# Altium schematic sheet 15_Temp.SchDoc: Power
size A3; Organization: Lime Microsystems; Address1: Surrey Tech Centre; Address2: Guildford GU2 7YG; Address3: Surrey; Address4: United Kingdom; Revision: v1.2; SheetNumber: 13; SheetTotal: 13
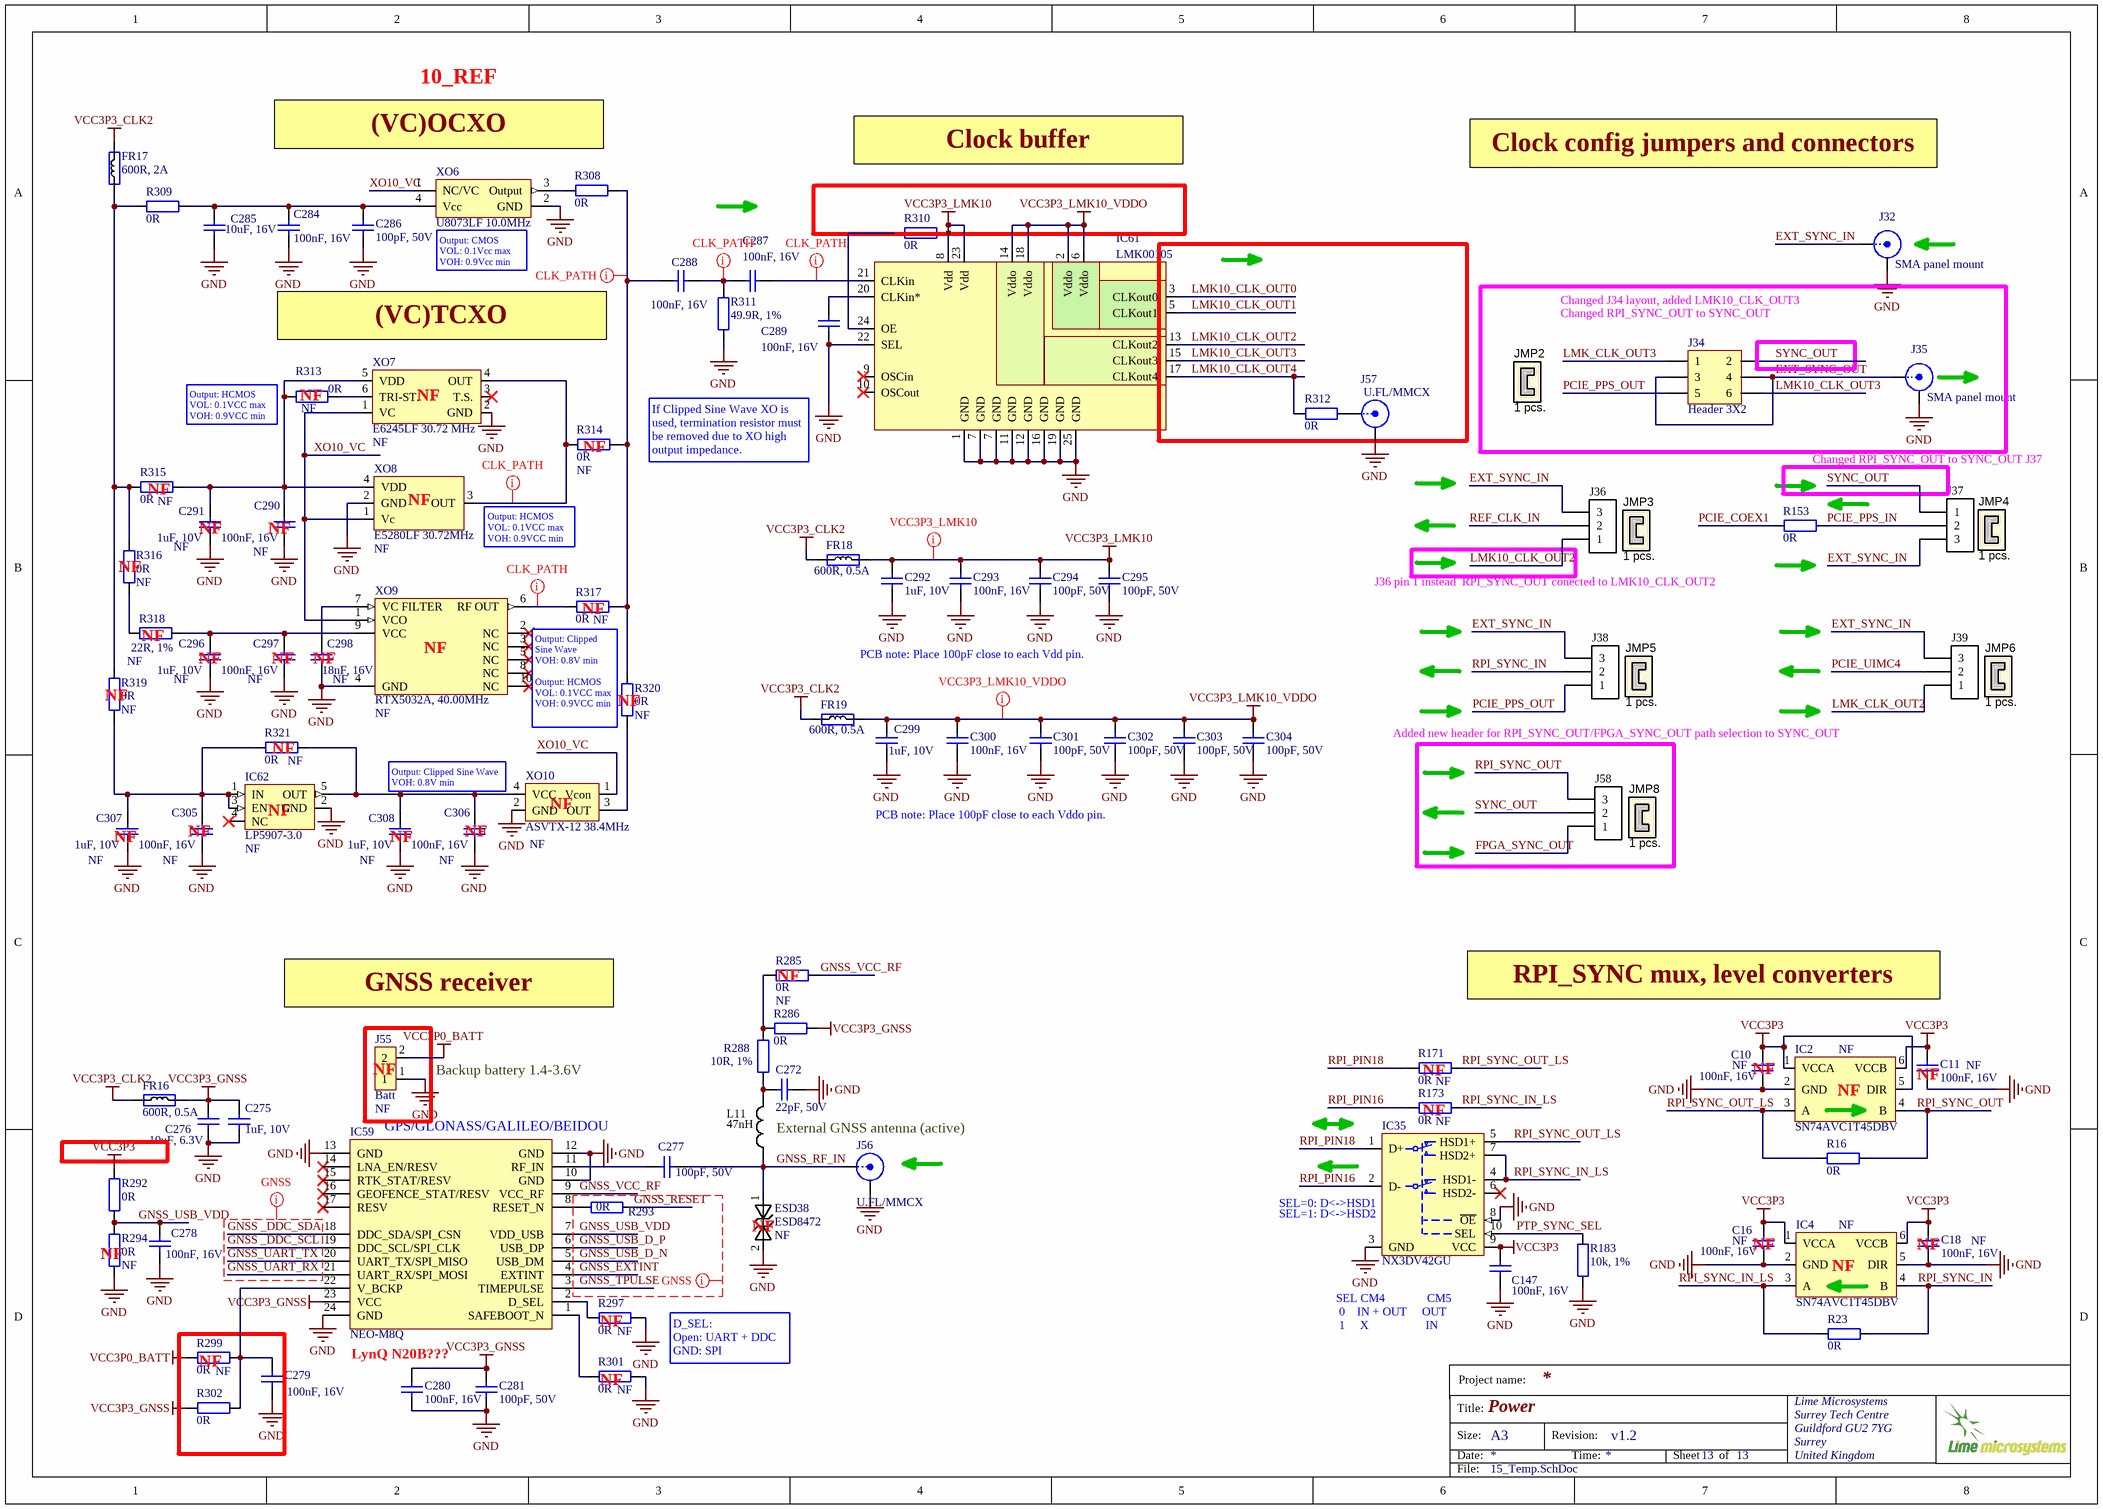
[diagram p0: 15_Temp.SchDoc]

## Parts
C10  100nF, 16V  Assembly Info: NF  [CAP0402]
C11  100nF, 16V  Assembly Info: NF  [CAP0402]
C16  100nF, 16V  Assembly Info: NF  [CAP0402]
C18  100nF, 16V  Assembly Info: NF  [CAP0402]
C147  100nF, 16V  [CAP0402]
C272  22pF, 50V  [CAP0402]
C275  1uF, 10V  [CAP0402]
C276  10uF, 6.3V  [CAP0603]
C277  100pF, 50V  [CAP0402]
C278  100nF, 16V  [CAP0402]
C279  100nF, 16V  [CAP0402]
C280  100nF, 16V  [CAP0402]
C281  100pF, 50V  [CAP0402]
C284  100nF, 16V  [CAP0402]
C285  10uF, 16V  [CAP0603]
C286  100pF, 50V  [CAP0402]
C287  100nF, 16V  [CAP0402]
C288  100nF, 16V  [CAP0402]
C289  100nF, 16V  [CAP0402]
C290  100nF, 16V  Assembly Info: NF  [CAP0402]
C291  1uF, 10V  Assembly Info: NF  [CAP0402]
C292  1uF, 10V  [CAP0402]
C293  100nF, 16V  [CAP0402]
C294  100pF, 50V  [CAP0402]
C295  100pF, 50V  [CAP0402]
C296  1uF, 10V  Assembly Info: NF  [CAP0402]
C297  100nF, 16V  Assembly Info: NF  [CAP0402]
C298  18nF, 16V  Assembly Info: NF  [CAP0402]
C299  1uF, 10V  [CAP0402]
C300  100nF, 16V  [CAP0402]
C301  100pF, 50V  [CAP0402]
C302  100pF, 50V  [CAP0402]
C303  100pF, 50V  [CAP0402]
C304  100pF, 50V  [CAP0402]
C305  100nF, 16V  Assembly Info: NF  [CAP0402]
C306  100nF, 16V  Assembly Info: NF  [CAP0402]
C307  1uF, 10V  Assembly Info: NF  [CAP0402]
C308  1uF, 10V  Assembly Info: NF  [CAP0402]
ESD38  ESD8472  Assembly Info: NF  [ESD8472_X3DFN2]
FR16  value 600R, 0.5A  [RES0402]  (hidden comment: Ferrite)
FR17  600R, 2A  [RES0805]
FR18  600R, 0.5A  [RES0402]
FR19  600R, 0.5A  [RES0402]
IC2  SN74AVC1T45DBV  Assembly Info: NF  [SOT23-6]
IC4  SN74AVC1T45DBV  Assembly Info: NF  [SOT23-6]
IC35  NX3DV42GU  [FSUSB42UMX]
IC59  NEO-M8Q  [NEO-7M/8M]
IC61  LMK00105  [LMK00105SQ]
IC62  LP5907-3.0  Assembly Info: NF  [SOT23-5]
J32  SMA panel mount  [SMA_connector_side]
J34  Header 3X2  [Header3x2]
J35  SMA panel mount  [SMA_connector_side]
J36  Header 3x1 pin  [HDR_1x3]  (value not drawn)
J37  Header 3x1 pin  [HDR_1x3]  (value not drawn)
J38  Header 3x1 pin  [HDR_1x3]  (value not drawn)
J39  Header 3x1 pin  [HDR_1x3]  (value not drawn)
J55  Batt  Assembly Info: NF  [HDR_1x2]
J56  U.FL/MMCX  [MMCX_UFL_conn_u]
J57  U.FL/MMCX  [MMCX_UFL_conn_u]
J58  Header 3x1 pin  [HDR_1x3]  (value not drawn)
JMP2  1 pcs.  (mechanical)
JMP3  1 pcs.  (mechanical)
JMP4  1 pcs.  (mechanical)
JMP5  1 pcs.  (mechanical)
JMP6  1 pcs.  (mechanical)
JMP8  1 pcs.  (mechanical)
L11  47nH  [RES0402]
R16  0R  [RES0402]
R23  0R  [RES0402]
R153  0R  [RES0402]
R171  0R  Assembly Info: NF  [RES0402]
R173  0R  Assembly Info: NF  [RES0402]
R183  10k, 1%  [RES0402]
R285  0R  Assembly Info: NF  [RES0402]
R286  0R  [RES0402]
R288  10R, 1%  [RES0402]
R292  0R  [RES0402]
R293  0R  [RES0402]
R294  0R  Assembly Info: NF  [RES0402]
R297  0R  Assembly Info: NF  [RES0402]
R299  0R  Assembly Info: NF  [RES0402]
R301  0R  Assembly Info: NF  [RES0402]
R302  0R  [RES0402]
R308  0R  [RES0402_v2]
R309  0R  [RES0402]
R310  0R  [RES0402]
R311  49.9R, 1%  [RES0402]
R312  0R  [RES0402]
R313  0R  Assembly Info: NF  [RES0402]
R314  0R  Assembly Info: NF  [RES0402_v2]
R315  0R  Assembly Info: NF  [RES0402]
R316  0R  Assembly Info: NF  [RES0402]
R317  0R  Assembly Info: NF  [RES0402_v2]
R318  22R, 1%  Assembly Info: NF  [RES0402]
R319  0R  Assembly Info: NF  [RES0402]
R320  0R  Assembly Info: NF  [RES0402_v2]
R321  0R  Assembly Info: NF  [RES0402]
XO6  U8073LF 10.0MHz  [AOCJYR-10.000MHz]
XO7  E6245LF 30.72 MHz  Assembly Info: NF  [RAKON_RPT7050A]
XO8  E5280LF 30.72MHz  Assembly Info: NF  [RAKON_TXCO]
XO9  RTX5032A, 40.00MHz  Assembly Info: NF  [RAKON_RTX5032A]
XO10  ASVTX-12 38.4MHz  Assembly Info: NF  [CRYSTAL_4-LCC_2P5x2P0]

## Nets
GND: C10.2 C11.2 C16.2 C18.2 C147.2 C272.1 C275.1 C276.1 C278.2 C279.2 C280.1 C281.2 C284.1 C285.1 C286.2 C289.1 C290.1 C291.1 C292.1 C293.1 C294.1 C295.1 C296.1 C297.1 C298.1 C299.1 C300.1 C301.1 C302.1 C303.1 C304.1 C305.1 C306.1 C307.1 C308.1 ESD38.2 IC2.2(GND) IC4.2(GND) IC4.5(DIR) IC35.3(GND) IC35.8(~{OE}) IC59.10(GND) IC59.12(GND) IC59.13(GND) IC59.24(GND) IC61.1(GND) IC61.7(GND) IC61.11(GND) IC61.12(GND) IC61.16(GND) IC61.19(GND) IC61.22(SEL) IC61.25(GND) IC62.2(GND) J32.2(Y) J35.2(Y) J55.1 J56.2(Y) J57.2(Y) R183.2 R294.1 R297.1 R301.1 R311.1 XO6.2(GND) XO7.2(GND) XO8.2(GND) XO9.4(GND) XO10.2(GND)
VCC3P0_BATT: J55.2 R299.2
VCC3P3: C10.1 C11.1 C16.1 C18.1 C147.1 IC2.1(VCCA) IC2.5(DIR) IC2.6(VCCB) IC4.1(VCCA) IC4.6(VCCB) IC35.9(VCC) R292.1
VCC3P3_CLK2: FR16.1 FR17.1 FR18.1 FR19.1
VCC3P3_GNSS: C275.2 C276.2 C280.2 C281.1 FR16.2 IC59.23(VCC) R286.1 R302.2
VCC3P3_LMK10: C292.2 C293.2 C294.2 C295.2 FR18.2 IC61.8(Vdd) IC61.23(Vdd) R310.2
VCC3P3_LMK10_VDDO: C299.2 C300.2 C301.2 C302.2 C303.2 C304.2 FR19.2 IC61.2(Vddo) IC61.6(Vddo) IC61.14(Vddo) IC61.18(Vddo)
EXT_SYNC_IN: J32.1(X) J36.3 J37.3 J38.3 J39.3
EXT_SYNC_OUT: J34.3 J34.4 J35.1(X)
FPGA_SYNC_OUT: J58.1
GNSS _DDC_SCL: IC59.19(DDC_SCL/SPI_CLK)
GNSS _DDC_SDA: IC59.18(DDC_SDA/SPI_CSN)
GNSS_EXTINT: IC59.4(EXTINT)
GNSS_RESET: R293.1
GNSS_RF_IN: C277.1 ESD38.1 J56.1(X) L11.1
GNSS_TPULSE: IC59.3(TIMEPULSE)
GNSS_UART_RX: IC59.21(UART_RX/SPI_MOSI)
GNSS_UART_TX: IC59.20(UART_TX/SPI_MISO)
GNSS_USB_D_N: IC59.5(USB_DM)
GNSS_USB_D_P: IC59.6(USB_DP)
GNSS_USB_VDD: C278.1 IC59.7(VDD_USB) R292.2 R294.2
GNSS_VCC_RF: IC59.9(VCC_RF) R285.2
LMK10_CLK_OUT0: IC61.3(CLKout0)
LMK10_CLK_OUT1: IC61.5(CLKout1)
LMK10_CLK_OUT2: IC61.13(CLKout2) J36.1
LMK10_CLK_OUT3: IC61.15(CLKout3) J34.6
LMK10_CLK_OUT4: IC61.17(CLKout4) R312.2
LMK_CLK_OUT2: J39.1
LMK_CLK_OUT3: J34.1
PCIE_COEX1: R153.2
PCIE_PPS_IN: J37.2 R153.1
PCIE_PPS_OUT: J34.5 J38.1
PCIE_UIMC4: J39.2
PTP_SYNC_SEL: IC35.10(SEL) R183.1
REF_CLK_IN: J36.2
RPI_PIN16: IC35.2(D-) R173.2
RPI_PIN18: IC35.1(D+) R171.2
RPI_SYNC_IN: IC4.4(B) J38.2 R23.1
RPI_SYNC_IN_LS: IC4.3(A) IC35.4(HSD1-) IC35.7(HSD2+) R23.2 R173.1
RPI_SYNC_OUT: IC2.4(B) J58.3 R16.1
RPI_SYNC_OUT_LS: IC2.3(A) IC35.5(HSD1+) R16.2 R171.1
SYNC_OUT: J34.2 J37.1 J58.2
XO10_VC: XO6.1(NC/VC) XO7.1(VC) XO8.1(Vc) XO9.1(VCO) XO10.1(Vcon)
NetC272_2: C272.2 L11.2 R288.1
NetC277_2: C277.2 IC59.11(RF_IN)
NetC279_1: C279.1 IC59.22(V_BCKP) R299.1 R302.1
NetC284_2: C284.2 C285.2 C286.1 R309.2 XO6.4(Vcc)
NetC287_1: C287.1 IC61.21(CLKin)
NetC287_2: C287.2 C288.1 R311.2
NetC288_2: C288.2 R308.1 R314.1 R317.2 R320.1
NetC289_2: C289.2 IC61.20(CLKin*)
NetC290_2: C290.2 C291.2 R313.2 R315.1 XO7.5(VDD) XO8.4(VDD)
NetC296_2: C296.2 C297.2 R318.2 XO9.9(VCC)
NetC298_2: C298.2 XO9.7(VC_FILTER)
NetC305_2: C305.2 C307.2 IC62.1(IN) IC62.3(EN) R319.2 R321.2
NetC306_2: C306.2 C308.2 IC62.5(OUT) R321.1 XO10.4(VCC)
NetFR17_2: FR17.2 R309.1 R315.2 R316.1 R319.1
NetIC59_1: IC59.1(SAFEBOOT_N) R301.2
NetIC59_2: IC59.2(D_SEL) R297.2
NetIC59_8: IC59.8(RESET_N) R293.2
NetIC61_24: IC61.24(OE) R310.1
NetJ57_1: J57.1(X) R312.1
NetR285_1: R285.1 R286.2 R288.2
NetR308_2: R308.2 XO6.3(Output)
NetR313_1: R313.1 XO7.6(TRI-ST.)
NetR314_2: R314.2 XO7.4(OUT) XO8.3(OUT)
NetR316_2: R316.2 R318.1
NetR317_1: R317.1 XO9.6(RF_OUT)
NetR320_2: R320.2 XO10.3(OUT)

Not connected (* = marked no-connect by the designer): IC35 6(HSD2-)*; IC59 14(LNA_EN/RESV)* 15(RTK_STAT/RESV)* 16(GEOFENCE_STAT/RESV)* 17(RESV)*; IC61 9(OSCin)* 10(OSCout)*; IC62 4(NC)*; JMP2 1 2; JMP3 1 2; JMP4 1 2; JMP5 1 2; JMP6 1 2; JMP8 1 2; XO7 3(T.S.)*; XO9 2(NC)* 3(NC)* 5(NC)* 8(NC)* 10(NC)*

## Layout directives
net class CLK_PATH: NetC287_1, NetC287_2, NetC288_2, NetR314_2, NetR317_1
net class VCC3P3_LMK10: VCC3P3_LMK10
net class VCC3P3_LMK10_VDDO: VCC3P3_LMK10_VDDO
net class GNSS: GNSS _DDC_SCL, GNSS _DDC_SDA, GNSS_EXTINT, GNSS_RESET, GNSS_TPULSE, GNSS_UART_RX, GNSS_UART_TX, GNSS_USB_D_N, GNSS_USB_D_P, GNSS_USB_VDD

## Notes on the sheet
- 10_REF
- (VC)OCXO
- Clock buffer
- Clock config jumpers and connectors
- (near XO6) Output: CMOS
  VOL: 0.1Vcc max
  VOH: 0.9Vcc min
- Changed J34 layout, added LMK10_CLK_OUT3
- Changed RPI_SYNC_OUT to SYNC_OUT
- (VC)TCXO
- (near R313) Output: HCMOS
  VOL: 0.1VCC max
  VOH: 0.9VCC min
- (near R313) NF
- (near XO7) NF
- (near R314) NF
- (near R315) NF
- (near XO8) NF
- (near R314) If Clipped Sine Wave XO is used, termination resistor must be removed due to XO high output impedance.
- Changed RPI_SYNC_OUT to SYNC_OUT J37
- (near R316) NF
- (near C291) NF
- (near C290) NF
- (near XO8) Output: HCMOS
  VOL: 0.1VCC max
  VOH: 0.9VCC min
- (near J36) J36 pin 1 instead  RPI_SYNC_OUT conected to LMK10_CLK_OUT2
- (near R318) NF
- (near XO9) NF
- (near R317) NF
- (near R319) NF
- (near C296) NF
- (near C297) NF
- (near C298) NF
- (near R320) Output: Clipped Sine Wave
  VOH: 0.8V min
  Output: HCMOS
  VOL: 0.1VCC max
  VOH: 0.9VCC min
- (near R320) NF
- PCB note: Place 100pF close to each Vdd pin.
- (near R321) NF
- Output: Clipped Sine Wave
  VOH: 0.8V min
- Added new header for RPI_SYNC_OUT/FPGA_SYNC_OUT path selection to SYNC_OUT
- (near C307) NF
- (near C305) NF
- (near IC62) NF
- (near C308) NF
- (near C306) NF
- (near XO10) NF
- PCB note: Place 100pF close to each Vddo pin.
- (near R285) NF
- (near J55) GNSS receiver
- RPI_SYNC mux, level converters
- (near J55) NF
- (near J55) Backup battery 1.4-3.6V
- (near R171) NF
- (near R173) NF
- (near C10) NF
- (near IC2) NF
- (near C11) NF
- (near IC59) GPS/GLONASS/GALILEO/BEIDOU
- (near L11) External GNSS antenna (active)
- (near R294) NF
- (near ESD38) NF
- (near IC35) SEL=0: D<->HSD1
- (near IC35) SEL=1: D<->HSD2
- (near C16) NF
- (near C18) NF
- (near R297) NF
- (near IC4) NF
- (near R299) NF
- LynQ N20B???
- (near R301) NF
- D_SEL:
  Open: UART + DDC
  GND: SPI
- (near C147) SEL CM4              CM5
  0    IN + OUT     OUT
  1     X                   IN
- Project name:
- Title:
- Size:
- Date:
- A3
- Revision:
- Time:
- Sheet
- of
- File:

## Library data of the parts
C10 C11 C16 C18 C147 C284 C287-C290 C293 C297 C300 = Cap_0402: Manufacturer: Murata Electronics; Manufacturer Part Number: GRM155R71C104KA88D; Part Description: 0.10µF ±10% 16V Ceramic Capacitor X7R 0402 (1005 Metric); Tolerance: 10 %; Type: General Purpose MLCC; Capacitance: 0.1 uF; Case Length: 1 mm; Dielectric: X7R; Case Height: 0.5 mm; Temperature Coefficient / Code: +/- 15 %; Value: 100nF, 16V; Supplier 1: Mouser; Supplier Part Number 1: 81-GRM155R71C104KA88; Case Code - in: 0402; RoHS: RoHS Compliant; Operating Temperature Range: - 55 C to + 125 C; Series: GRM; Termination Style: SMD/SMT; Package / Case: 0402 (1005 metric); Voltage Rating DC: 16 V; Maximum Operating Temperature: + 125 C; Case Code - mm: 1005; Minimum Operating Temperature: - 55 C; Product Category: Low & Medium Capacitance SMD Ceramic Chip Capacitors; Packaging: Reel; Product: General Type MLCCs; Category: Multilayer Ceramic Capacitors MLCC - SMD/SMT; Brand: Murata Electronics; Case Width: 0.5 mm; RoHS - Mouser: Y; Standard Pack Qty: 10000; Minimum Order Quantity: 1; Reeling: True; Manufacturer Part Number 1: GRM155R71C104KA88D
C272 = Cap_0402: Manufacturer: Yageo; Manufacturer Part Number 1: CC0402JRNPO9BN220; Part Description: 22pF ±5% 50V C0G, NP0 Ceramic Capacitor -55°C ~ 125°C Surface Mount, MLCC 0402 (1005 Metric) 0.039" L x 0.020" W (1.00mm x 0.50mm); Tolerance: ±5%; Temperature Coefficient: C0G, NP0; Value: 22pF, 50V; Supplier 1: Digi-Key; Supplier Part Number 1: 311-1018-2-ND; Category: Capacitors; Voltage - Rated: 50V; Packaging: Tape & Reel (TR); RoHS: RoHS Compliant; Capacitance: 22pF; Operating Temperature: -55°C ~ 125°C; Mounting Type: Surface Mount, MLCC; Height - Seated (Max): -; Size / Dimension: 0.039" L x 0.020" W (1.00mm x 0.50mm); Ratings: -; Applications: General Purpose; Thickness (Max): 0.022" (0.55mm); Lead Spacing: -; Lead Style: -; Features: -; Package / Case: 0402 (1005 Metric)
C275 = Cap_0402: CAP CER 1UF 10V X5R 0402; Manufacturer: TDK; Part Description: 1µF ±10% 10V X5R Ceramic Capacitor -55°C ~ 85°C Surface Mount, MLCC 0402 (1005 Metric) 0.039" L x 0.020" W (1.00mm x 0.50mm); Manufacturer Part Number 1: C1005X5R1E105K050BC; Voltage Rating: 10; Capacitance: 1; Capacitance Tolerance: ± 10%; Ceramic Capacitor Case: 0402 [1005 Metric]; Dielectric Characteristic: X6; Product Range: TDK - C Series; Value: 1uF, 10V; Supplier 1: Digi-Key; Supplier Part Number 1: 445-9066-1-ND; RoHS: YES; MSL: -
C276 = Cap_0603: Manufacturer Part Number 1: CC0603MRX5R5BB106; Manufacturer: Yageo; Part Description: 10µF ±20% 6.3V X5R Ceramic Capacitor -55°C ~ 85°C Surface Mount, MLCC 0603 (1608 Metric) 0.063" L x 0.031" W (1.60mm x 0.80mm); Capacitance: 10µF; Tolerance: ±20%; Supplier 1: Digi-Key; Supplier Part Number 1: 311-1448-2-ND; Package / Case: 0603 (1608 Metric); Category: Capacitors; Voltage - Rated: 6.3V; Value: 10uF, 6.3V
C277 C281 C286 = Cap_0402: Manufacturer Part Number 1: CC0402JRNPO9BN101; Manufacturer: Yageo; Part Description: 100pF ±5% 50V C0G, NP0 Ceramic Capacitor -55°C ~ 125°C Surface Mount, MLCC 0402 (1005 Metric) 0.039" L x 0.020" W (1.00mm x 0.50mm); Tolerance: ±5%; Temperature Coefficient: C0G, NP0; Value: 100pF, 50V; Capacitance: 100pF; Thickness (Max): 0.022" (0.55mm); Size / Dimension: 0.039" L x 0.020" W (1.00mm x 0.50mm); RoHS: RoHS Compliant; Ratings: -; Package / Case: 0402 (1005 Metric); Mounting Type: Surface Mount, MLCC; Height - Seated (Max): -; Features: -; Lead Spacing: -; Voltage - Rated: 50V; Operating Temperature: -55°C ~ 125°C; Packaging: Cut Tape (CT); Applications: General Purpose; Lead Style: -; Supplier 1: Digi-Key; Category: Capacitors; Supplier Part Number 1: 311-1024-1-ND
C278 C279 = Cap_0603: Manufacturer Part Number 1: GRM155R71C104KA88D; Part Description: 0.10µF ±10% 16V X7R Ceramic Capacitor -55°C ~ 125°C Surface Mount, MLCC 0402 (1005 Metric) 0.039" L x 0.020" W (1.00mm x 0.50mm); Brand: Murata Electronics; Tolerance: 10 %; Type: General Purpose MLCC; Capacitance: 0.1 uF; Temperature Coefficient / Code: +/- 15 %; Case Height: 0.5 mm; Case Length: 1 mm; Dielectric: X7R; Supplier 1: Mouser; Supplier Part Number 1: 81-GRM155R71C104KA88; Case Code - in: 0402; Manufacturer: Murata Electronics; Category: Multilayer Ceramic Capacitors MLCC - SMD/SMT; Voltage Rating DC: 16 V; Value: 100nF, 16V; Manufacturer Part Number: GRM155R71C104KA88D; Case Code - mm: 1005; Case Width: 0.5 mm; Maximum Operating Temperature: + 125 C; Minimum Operating Temperature: - 55 C; Minimum Order Quantity: 1; Operating Temperature Range: - 55 C to + 125 C; Package / Case: 0402 (1005 metric); Packaging: Reel; Product: General Type MLCCs; Product Category: Low & Medium Capacitance SMD Ceramic Chip Capacitors; Reeling: True; RoHS - Mouser: Y; RoHS: RoHS Compliant; Series: GRM; Standard Pack Qty: 10000; Termination Style: SMD/SMT
C280 = Cap_0402: Manufacturer: Murata Electronics; Manufacturer Part Number: GRM155R71C104KA88D; Part Description: 0.10µF ±10% 16V X7R Ceramic Capacitor -55°C ~ 125°C Surface Mount, MLCC 0402 (1005 Metric) 0.039" L x 0.020" W (1.00mm x 0.50mm); Tolerance: 10 %; Type: General Purpose MLCC; Capacitance: 0.1 uF; Case Length: 1 mm; Dielectric: X7R; Case Height: 0.5 mm; Temperature Coefficient / Code: +/- 15 %; Value: 100nF, 16V; Supplier 1: Mouser; Supplier Part Number 1: 81-GRM155R71C104KA88; Case Code - in: 0402; RoHS: RoHS Compliant; Operating Temperature Range: - 55 C to + 125 C; Series: GRM; Termination Style: SMD/SMT; Package / Case: 0402 (1005 metric); Voltage Rating DC: 16 V; Maximum Operating Temperature: + 125 C; Case Code - mm: 1005; Minimum Operating Temperature: - 55 C; Product Category: Low & Medium Capacitance SMD Ceramic Chip Capacitors; Packaging: Reel; Product: General Type MLCCs; Category: Multilayer Ceramic Capacitors MLCC - SMD/SMT; Brand: Murata Electronics; Case Width: 0.5 mm; RoHS - Mouser: Y; Standard Pack Qty: 10000; Minimum Order Quantity: 1; Reeling: True; Manufacturer Part Number 1: GRM155R71C104KA88D
C285 = Cap_0603: Manufacturer: Yageo; Manufacturer Part Number 1: GRM188R61C106MA73D; Part Description: 10µF ±20% 16V Ceramic Capacitor X5R 0603 (1608 Metric); Temperature Coefficient: X5R; Capacitance: 10µF; Tolerance: ±20%; Value: 10uF, 16V; Supplier 1: Digi-Key; Supplier Part Number 1: 490-7201-2-ND; Category: Capacitors; Ratings: -; Features: -; Lead Style: -; Package / Case: 0603 (1608 Metric); Lead Spacing: -; Applications: General Purpose; Voltage - Rated: 16V; Operating Temperature: -55°C ~ 85°C; Thickness (Max): 0.039" (1.00mm); Mounting Type: Surface Mount, MLCC; RoHS: RoHS Compliant; Size / Dimension: 0.063" L x 0.031" W (1.60mm x 0.80mm); Packaging: Tape & Reel (TR); Height - Seated (Max): -
C291 C296 = Cap_0402: CAP CER 1UF 10V X5R 0402; Manufacturer: Yageo; Part Description: 1µF 10V Ceramic Capacitor X5R 0402 (1005 Metric) 0.039" L x 0.020" W (1.00mm x 0.50mm); Manufacturer Part Number 1: CC0402MRX5R6BB105; Voltage Rating: 10; Capacitance: 1; Capacitance Tolerance: ± 10%; Ceramic Capacitor Case: 0402 [1005 Metric]; Dielectric Characteristic: X6; Product Range: TDK - C Series; Value: 1uF, 10V; Supplier 1: Digi-Key; Supplier Part Number 1: 311-1732-1-ND; RoHS: YES; MSL: -
C292 C299 = Cap_0402: CAP CER 1UF 10V X5R 0402; Manufacturer: Yageo; Part Description: 1µF 10V Ceramic Capacitor X5R 0402 (1005 Metric) 0.039" L x 0.020" W (1.00mm x 0.50mm); Manufacturer Part Number 1: CC0402MRX5R6BB105; Notification: Current market demand for these product types have resulted in fluctuating and extending lead times. Lead times may differ.; Tolerance: ±20%; Value: 1uF, 10V; Supplier 1: Digi-Key; Supplier Part Number 1: 311-1732-1-ND; RoHS: RoHS Compliant; Applications: General Purpose; Category: Capacitors; ComponentLink1Description: http://www.yageo.com/documents/recent/UPY-GPHC_X5R_4V-to-50V_25.pdf; ComponentLink1URL: http://www.yageo.com/documents/recent/UPY-GPHC_X5R_4V-to-50V_25.pdf; Failure Rate: -; Features: -; Height - Seated (Max): -; Lead Spacing: -; Lead Style: -; Mounting Type: Surface Mount, MLCC; Operating Temperature: -55°C ~ 85°C; Package / Case: 0402 (1005 Metric); Packaging: Cut Tape (CT); Part Status: Active; Pricing 1: 1=0.22, 10=0.156, 100=0.0732, 500=0.0513, 1000=0.04248, 2500=0.03953, 5000=0.03617 (USD); Ratings: -; Size / Dimension: 0.039" L x 0.020" W (1.00mm x 0.50mm); Stock 1: 69600; Temperature Coefficient: X5R; Thickness (Max): 0.022" (0.55mm); Voltage - Rated: 10V
C294 C295 C301-C304 = Cap_0402: Manufacturer Part Number 1: CC0402JRNPO9BN101; Manufacturer: Yageo; Part Description: 100pF ±5% 50V C0G, NP0 Ceramic Capacitor -55°C ~ 125°C Surface Mount, MLCC 0402 (1005 Metric) 0.039" L x 0.020" W (1.00mm x 0.50mm); Temperature Coefficient: C0G, NP0; Tolerance: ±5%; Value: 100pF, 50V; Supplier 1: Digi-Key; Supplier Part Number 1: 311-1024-1-ND; RoHS: RoHS Compliant; Category: Capacitors; Applications: General Purpose; Mounting Type: Surface Mount, MLCC; Capacitance: 100pF; Ratings: -; Packaging: Cut Tape (CT); Voltage - Rated: 50V; Size / Dimension: 0.039" L x 0.020" W (1.00mm x 0.50mm); Height - Seated (Max): -; Package / Case: 0402 (1005 Metric); Operating Temperature: -55°C ~ 125°C; Features: -; Lead Spacing: -; Lead Style: -; Thickness (Max): 0.022" (0.55mm)
C298 = Cap_0402: Manufacturer: Yageo; Manufacturer Part Number 1: CC0402KRX7R7BB183; Part Description: 0.018µF ±10% 16V Ceramic Capacitor X7R 0402 (1005 Metric); Temperature Coefficient: X7R; Capacitance: 0.018µF; Tolerance: ±10%; Value: 18nF, 16V; Supplier 1: Digi-Key; Supplier Part Number 1: 311-1706-1-ND; Part Status: Active; Category: Capacitors; Packaging: Cut Tape (CT); Voltage - Rated: 16V; RoHS: RoHS Compliant; Size / Dimension: 0.039" L x 0.020" W (1.00mm x 0.50mm); Package / Case: 0402 (1005 Metric); Mounting Type: Surface Mount, MLCC; Thickness (Max): 0.022" (0.55mm); Applications: General Purpose; Operating Temperature: -55°C ~ 125°C
C305 C306 = Cap_0402: Manufacturer: Murata Electronics; Manufacturer Part Number 1: GRM155R71C104KA88D; Part Description: 0.10µF ±10% 16V Ceramic Capacitor X7R 0402 (1005 Metric); Tolerance: 10 %; Type: General Purpose MLCC; Capacitance: 0.1 uF; Case Length: 1 mm; Dielectric: X7R; Case Height: 0.5 mm; Temperature Coefficient / Code: +/- 15 %; Value: 100nF, 16V; Supplier 1: Mouser; Supplier Part Number 1: 81-GRM155R71C104KA88; Case Code - in: 0402; RoHS: RoHS Compliant; Operating Temperature Range: - 55 C to + 125 C; Series: GRM; Termination Style: SMD/SMT; Package / Case: 0402 (1005 metric); Voltage Rating DC: 16 V; Maximum Operating Temperature: + 125 C; Case Code - mm: 1005; Minimum Operating Temperature: - 55 C; Product Category: Low & Medium Capacitance SMD Ceramic Chip Capacitors; Packaging: Reel; Product: General Type MLCCs; Category: Multilayer Ceramic Capacitors MLCC - SMD/SMT; Brand: Murata Electronics; Case Width: 0.5 mm; RoHS - Mouser: Y; Standard Pack Qty: 10000; Minimum Order Quantity: 1; Reeling: True; Manufacturer Part Number: GRM155R71C104KA88D
C307 C308 = Cap_0402: Manufacturer Part Number 1: CC0402MRX5R6BB105; Manufacturer: Yageo; Part Description: 1µF 10V Ceramic Capacitor X5R 0402 (1005 Metric) 0.039" L x 0.020" W (1.00mm x 0.50mm); Voltage Rating: 10; Capacitance Tolerance: ± 10%; Product Range: TDK - C Series; Ceramic Capacitor Case: 0402 [1005 Metric]; Capacitance: 1; Dielectric Characteristic: X6; Value: 1uF, 10V; Supplier 1: Digi-Key; Supplier Part Number 1: 311-1732-1-ND; MSL: -; RoHS: YES
ESD38 = ESD8472: Manufacturer: ON Semiconductor; Manufacturer Part Number: ESD8472MUT5G; Part Description: TVS DIODE 5.3VWM 14VC X3DFN2; Voltage - Reverse Standoff (Typ): 5.3V (Max); Voltage - Breakdown (Min): 7V; Voltage - Clamping (Max) @ Ipp: 14V; Current - Peak Pulse (10/1000µs): 3A (8/20µs); Power Line Protection: No; Capacitance @ Frequency: 0.2pF @ 1MHz; Supplier 1: Digi-Key; RoHS: RoHS Compliant; Category: Circuit Protection; Stock 1: 2295; Pricing 1: 1=0.39, 10=0.315, 100=0.2142, 500=0.16068, 1000=0.12051 (USD); Packaging: Cut Tape (CT); Part Status: Active; Type: Zener; Power - Peak Pulse: -; Applications: Automotive, RF Antenna; Operating Temperature: -55°C ~ 150°C (TJ); Mounting Type: Surface Mount; Package / Case: 2-XFDFN; Supplier Device Package: 2-X3DFN (0.62x0.32); ComponentLink1URL: http://www.onsemi.com/pub/Collateral/ESD8472-D.PDF; ComponentLink1Description: http://www.onsemi.com/pub/Collateral/ESD8472-D.PDF; Supplier Part Number 1: ESD8472MUT5GOSCT-ND; Manufacturer Part Number 1: ESD8472MUT5G
FR16 = Ferrite: Manufacturer: Murata; Manufacturer Part Number 1: BLM15AX601SN1D; Part Description: - Ferrite Bead 0402 (1005 Metric) 500mA 340mOhm; Tolerance: 25%; Impedance: 600R; Current Rating: 500mA; Number of Lines: 1; DC Resistance (DCR): 340mR; Test Frequency: 100MHz; Supplier 1: Digi-Key; Supplier Part Number 1: 490-5441-1-ND; Stock 1: 416370; Pricing 1: 1=0.1, 10=0.06, 25=0.0552, 50=0.0496, 100=0.0363, 250=0.0264, 500=0.0242, 1000=0.0209, 5000=0.0165 (USD); Case/Package: 0402; Number of Pins: 2; Case Code (Metric): 1005; Case Code (Imperial): 0402; Core Material: Ferrite; Material: Steel,Ferrite; Min Operating Temperature: -55°C; Max Operating Temperature: 125°C; Package Quantity: 1; Packaging: Tape and Reel; Series: BLM15AX_SN; Max Current Rating: 500mA; Termination: SMD/SMT; Max DC Current: 500mA; Number of Circuits: 1; DC Resistance-Max: 340mR; Length: 1mm; Width: 0.5mm; Height: 0.5mm; Depth: 0.5mm; REACH SVHC: No SVHC; Lead Free: Lead Free; RoHS Compliant: Yes; ComponentLink1URL: https://www.murata.com/en-us/products/productdata/8796740059166/ENFA0018.pdf?src-supplier=Digi-Key; ComponentLink1Description: https://www.murata.com/en-us/products/productdata/8796740059166/ENFA0018.pdf?src-supplier=Digi-Key; ComponentLink2URL: http://search.murata.co.jp/Ceramy/image/img/PDF/ENG/L0110S0100BLM15AX_SN.pdf?src-supplier=Future+Electronics; ComponentLink2Description: http://search.murata.co.jp/Ceramy/image/img/PDF/ENG/L0110S0100BLM15AX_SN.pdf?src-supplier=Future+Electronics; ComponentLink3URL: http://www.produktinfo.conrad.com/datenblaetter/1100000-1199999/001171675-da-01-en-CHIP_DROSSEL0402_600R_420MA_1_0X0_5MM.pdf?src-supplier=Conrad; ComponentLink3Description: http://www.produktinfo.conrad.com/datenblaetter/1100000-1199999/001171675-da-01-en-CHIP_DROSSEL0402_600R_420MA_1_0X0_5MM.pdf?src-supplier=Conrad; ComponentLink4URL: http://www.produktinfo.conrad.com/datenblaetter/1100000-1199999/001172169-da-01-en-DROSSEL_0402_600R_1_0X0_5MM_10000ST.pdf?src-supplier=Conrad; ComponentLink4Description: http://www.produktinfo.conrad.com/datenblaetter/1100000-1199999/001172169-da-01-en-DROSSEL_0402_600R_1_0X0_5MM_10000ST.pdf?src-supplier=Conrad
FR17 = Ferrite: Manufacturer Part Number 1: MPZ2012S601AT000; Manufacturer: TDK Corporation; Part Description: FERRITE BEAD 600 OHM 0805 1LN; DC Resistance (DCR): 100 mOhm Max; Filter Type: Differential Mode - Single; Impedance @ Frequency: 600 Ohm @ 100MHz; Supplier 1: Digi-Key; Supplier Part Number 1: 445-2206-2-ND; Value: 600R, 2A; Category: Filters; Current Rating: 2A; Height (Max): 0.041" (1.05mm); Mounting Type: Surface Mount; Package / Case: 0805 (2012 Metric); Packaging: Tape & Reel (TR); RoHS: RoHS Compliant; Size / Dimension: 0.079" L x 0.049" W (2.00mm x 1.25mm)
FR18 FR19 = Ferrite: Manufacturer: Murata; Manufacturer Part Number 1: BLM15AX601SN1D; Part Description: - Ferrite Bead 0402 (1005 Metric) 500mA 340mOhm; Tolerance: 25%; Current Rating: 500mA; Number of Lines: 1; DC Resistance (DCR): 340mR; Test Frequency: 100MHz; Value: 600R, 0.5A; Supplier 1: Digi-Key; Supplier Part Number 1: 490-5441-1-ND; Stock 1: 416370; Pricing 1: 1=0.1, 10=0.06, 25=0.0552, 50=0.0496, 100=0.0363, 250=0.0264, 500=0.0242, 1000=0.0209, 5000=0.0165 (USD); Case/Package: 0402; Number of Pins: 2; Case Code (Metric): 1005; Case Code (Imperial): 0402; Core Material: Ferrite; Material: Steel,Ferrite; Min Operating Temperature: -55°C; Max Operating Temperature: 125°C; Package Quantity: 1; Packaging: Tape and Reel; Series: BLM15AX_SN; Impedance: 600R; Max Current Rating: 500mA; Termination: SMD/SMT; Max DC Current: 500mA; Number of Circuits: 1; DC Resistance-Max: 340mR; Length: 1mm; Width: 0.5mm; Height: 0.5mm; Depth: 0.5mm; REACH SVHC: No SVHC; Lead Free: Lead Free; RoHS Compliant: Yes; ComponentLink1URL: https://www.murata.com/en-us/products/productdata/8796740059166/ENFA0018.pdf?src-supplier=Digi-Key; ComponentLink1Description: https://www.murata.com/en-us/products/productdata/8796740059166/ENFA0018.pdf?src-supplier=Digi-Key; ComponentLink2URL: http://search.murata.co.jp/Ceramy/image/img/PDF/ENG/L0110S0100BLM15AX_SN.pdf?src-supplier=Future+Electronics; ComponentLink2Description: http://search.murata.co.jp/Ceramy/image/img/PDF/ENG/L0110S0100BLM15AX_SN.pdf?src-supplier=Future+Electronics; ComponentLink3URL: http://www.produktinfo.conrad.com/datenblaetter/1100000-1199999/001171675-da-01-en-CHIP_DROSSEL0402_600R_420MA_1_0X0_5MM.pdf?src-supplier=Conrad; ComponentLink3Description: http://www.produktinfo.conrad.com/datenblaetter/1100000-1199999/001171675-da-01-en-CHIP_DROSSEL0402_600R_420MA_1_0X0_5MM.pdf?src-supplier=Conrad; ComponentLink4URL: http://www.produktinfo.conrad.com/datenblaetter/1100000-1199999/001172169-da-01-en-DROSSEL_0402_600R_1_0X0_5MM_10000ST.pdf?src-supplier=Conrad; ComponentLink4Description: http://www.produktinfo.conrad.com/datenblaetter/1100000-1199999/001172169-da-01-en-DROSSEL_0402_600R_1_0X0_5MM_10000ST.pdf?src-supplier=Conrad
IC2 IC4 = SN74AVC1T45DBV: Manufacturer: Texas Instruments; Manufacturer Part Number 1: SN74AXC1T45DBVR; Part Description: Voltage Level Translator Bidirectional 1 Circuit 1 Channel 500Mbps SOT-23-6; Number of Bits: 1; Channel Type: Bidirectional; Data Rate: 500Mbps; Supplier 1: Digi-Key; Supplier Part Number 1: 296-47598-1-ND; Stock 1: 116252; Pricing 1: 1=0,68000, 10=0,59800, 25=0,56200, 100=0,45860, 250=0,42596, 500=0,36252, 1000=0,29002 (USD); RoHS: Yes; Mount: Surface Mount; Case/Package: SOT-23-6; Min Operating Temperature: -40°C; Max Operating Temperature: 125°C; Packaging: Cut Tape; Number of Circuits: 1; RoHS Compliant: Yes; ComponentLink1URL: http://www.ti.com/lit/ds/symlink/sn74axc1t45.pdf?src-supplier=Digi-Key; ComponentLink1Description: http://www.ti.com/lit/ds/symlink/sn74axc1t45.pdf?src-supplier=Digi-Key; ComponentLink2URL: http://www.ti.com/general/docs/suppproductinfo.tsp?distId=10&amp;gotoUrl=http%3A%2F%2Fwww.ti.com%2Flit%2Fgpn%2Fsn74axc1t45&src-supplier=Digi-Key; ComponentLink2Description: http://www.ti.com/general/docs/suppproductinfo.tsp?distId=10&amp;gotoUrl=http%3A%2F%2Fwww.ti.com%2Flit%2Fgpn%2Fsn74axc1t45&src-supplier=Digi-Key
IC35 = FSUSB42UMX: Part Description: USB Switch IC 1 Channel 10-UMLP (1.8x1.4); Manufacturer: NXP Semiconductors; Manufacturer Part Number 1: NX3DV42GU,115; ComponentLink1URL: https://www.fairchildsemi.com/datasheets/FS/FSUSB42.pdf; ComponentLink1Description: https://www.fairchildsemi.com/datasheets/FS/FSUSB42.pdf; Supplier 1: Digikey; Supplier Part Number 1: 568-12388-1-ND; Stock 1: 3109; Pricing 1: 1=0,89, 10=0,781, 25=0,7336, 100=0,5987, 250=0,55612, 500=0,47328, 1000=0,37863 (USD); RoHS: Yes; ComponentLink2URL: http://www.mouser.com/ds/2/302/NX3DV42-1127466.pdf?src-supplier=Mouser; ComponentLink2Description: http://www.mouser.com/ds/2/302/NX3DV42-1127466.pdf?src-supplier=Mouser; ComponentLink3URL: http://www.nxp.com/documents/data_sheet/NX3DV42.pdf?src-supplier=Avnet; ComponentLink3Description: http://www.nxp.com/documents/data_sheet/NX3DV42.pdf?src-supplier=Avnet; ComponentLink4URL: http://www.nxp.com/documents/data_sheet/NX3DV42.pdf?src-supplier=Digikey; ComponentLink4Description: http://www.nxp.com/documents/data_sheet/NX3DV42.pdf?src-supplier=Digikey; ComponentLink5URL: https://www.nxp.com/docs/en/data-sheet/NX3DV42.pdf?src-supplier=Digikey; ComponentLink5Description: https://www.nxp.com/docs/en/data-sheet/NX3DV42.pdf?src-supplier=Digikey
IC59 = NEO-M8P_M8M: GNSS engine for GPS/QZSS, GLONASS; Manufacturer: U-blox; Manufacturer Part Number 1: NEO-M8Q-0; Part Description: IC RECEIVER GPS/GNSS 24LCC; Frequency: 1.575GHz; Sensitivity: -167dBm; Modulation or Protocol: BeiDou, Galileo, GLONASS, GNSS, GPS; Current - Receiving: 21mA; Data Interface: I2C, SPI, UART, USB; Voltage - Supply: 1.65 V ~ 3.6 V; DatasheetVersion: R07 11-Nov-2014; PackageDescription: NEO-7 series 12.2 x 16 x 2.4 mm; ComponentLink1URL: https://www.u-blox.com/en/product/neo-7-series; ComponentLink2Description: Datasheet; ComponentLink1Description: https://www.u-blox.com/en/product/neo-7-series; Supplier 1: Digi-Key; Supplier Part Number 1: 672-1009-1-ND; RoHS: RoHS Compliant; Category: RF/IF and RFID; Stock 1: 444; Pricing 1: 1=30.59, 10=26.65, 50=17.3, 100=13.169 (USD); Packaging: Cut Tape (CT); Part Status: Active; Data Rate (Max): -; Applications: General Purpose; Memory Size: -; Antenna Connector: -; Features: -; Operating Temperature: -40°C ~ 85°C; Package / Case: 24-SMD Module; Supplier Device Package: -; ComponentLink3URL: https://www.u-blox.com/sites/default/files/NEO-M8-FW3_DataSheet_(UBX-15031086).pdf; ComponentLink3Description: https://www.u-blox.com/sites/default/files/NEO-M8-FW3_DataSheet_(UBX-15031086).pdf
IC61 = LMK00105: Manufacturer: Texas Instruments; Manufacturer Part Number 1: LMK00105SQ/NOPB; Part Description: IC CLK BUFFER 2:5 200MHZ 24WQFN; Frequency - Max: 200MHz; Voltage - Supply: 2.375 V ~ 3.45 V; Input: HCSL, LVCMOS, LVDS, LVPECL, LVTTL, SSTL, Crystal; Differential - Input:Output: Yes/No; Supplier 1: Digi-Key; Type: Fanout Buffer (Distribution), Multiplexer, Translator; Category: Integrated Circuits (ICs); Operating Temperature: -40°C ~ 85°C; Package / Case: 24-WFQFN Exposed Pad; Supplier Device Package: 24-WQFN (4x4); Supplier Part Number 1: LMK00105SQ/NOPBCT-ND
IC62 = LP5907: Manufacturer: Texas Instruments; Manufacturer Part Number 1: LP5907QMFX-3.0Q1; Part Description: Linear Voltage Regulator IC Positive Fixed 1 Output  250mA SOT-23-5; Number of Outputs: 1; Min Input Voltage: 2.2V; Max Input Voltage: 5.5V; Max Output Current: 250mA; Output Voltage: 3V; Dropout Voltage: 50mV; Polarity: Positive; Quiescent Current: 425uA; Accuracy: 2%; Output Type: Fixed; Supplier 1: Digi-Key; Stock 1: 90911; Pricing 1: 1 = 0,65000, 10 = 0,56000, 100 = 0,41820, 500 = 0,32858, 1000 = 0,25390 (USD); RoHS: Yes; Mount: Surface Mount; Case/Package: SOT-23-5; Min Operating Temperature: -40°C; Max Operating Temperature: 125°C; Packaging: Tape and Reel; Output Current: 250mA; Number of Regulators: 1; Radiation Hardening: No; Lead Free: Lead Free; ComponentLink1URL: https://datasheet.ciiva.com/48677/lp5907-q1-48677562.pdf?src-supplier=Avnet; ComponentLink1Description: https://datasheet.ciiva.com/48677/lp5907-q1-48677562.pdf?src-supplier=Avnet; Supplier Part Number 1: 296-40364-1-ND
J32 J35 = RF_IF_connector: CONN SMA JACK STR 50OHM EDGE MNT; Manufacturer: Linx; Manufacturer Part Number 1: CONSMA002-L-G; Part Description: SMA Connector Receptacle, Female Socket 50Ohm Panel Mount, Through Hole, Right Angle Solder; Supplier 1: Digi-Key; Supplier Part Number 1: CONSMA002-L-G-ND; Stock 1: 815; Pricing 1: 1=4.08, 25=3.67, 100=3.32, 250=3.25, 500=3, 1000=2.80001, 2000=2.5875 (USD)
J34 = Header 3X2: Header, 2-Pin, Dual row; Manufacturer 1: Adam Equipment; Manufacturer Part Number: PH2-06-UA; Part Description: Connector Header Through Hole 6 position 0.100" (2.54mm); ComponentLink1URL: http://uk.rs-online.com/webdocs/1406/0900766b81406898.pdf; ComponentLink1Description: http://uk.rs-online.com/webdocs/1406/0900766b81406898.pdf; ComponentLink2URL: https://www.verical.com/server-webapp/html/getDatasheet?partID=483857; ComponentLink2Description: https://www.verical.com/server-webapp/html/getDatasheet?partID=483857; ComponentLink3URL: http://www.farnell.com/cad/112195.pdf; ComponentLink3Description: http://www.farnell.com/cad/112195.pdf; Supplier 1: Digi-Key; Supplier Part Number 1: 2057-PH2-06-UA-ND; Stock 1: 59749; Pricing 1: 1=0,13000, 10=0,10400, 100=0,07640, 500=0,06326, 1000=0,05535, 5000=0,04744, 10000=0,04612 (USD); RoHS: Yes; Lead Free: Lead Free; ComponentLink4URL: https://datasheet.ciiva.com/16479/page-292-295-16479745.pdf?src-supplier=Future+Electronics; ComponentLink4Description: https://datasheet.ciiva.com/16479/page-292-295-16479745.pdf?src-supplier=Future+Electronics; Manufacturer: Adam Equipment; Manufacturer Part Number 1: PH2-06-UA
J36-J39 J58 = Header3P: Header, 3-pin; Manufacturer 1: Wurth Electronics; Manufacturer Part Number: 61300311121; Part Description: Connector Header Through Hole 3 position 0.100" (2.54mm); Number of Positions: 3; Gender: Male; Connector Type: Male Pin; Pitch: 0.1inch; Supplier 1: Digi-Key; Supplier Part Number 1: 732-5316-ND; Stock 1: 95926; Pricing 1: 1=0,13000, 10=0,11300, 25=0,09400, 50=0,07900, 100=0,07100, 1000=0,06600 (USD); RoHS: Yes; Mount: Through Hole; Contact Plating: Gold; Contact Material: Copper; Color: Black; Number of Rows: 1; Packaging: Bulk; Termination: Solder; Number of Contacts: 3; Contact Mating Length: 0.236inch; REACH SVHC: Unknown; Lead Free: Lead Free; RoHS Compliant: Yes; ComponentLink1URL: http://www.farnell.com/cad/1737268.pdf?src-supplier=Element14; ComponentLink1Description: http://www.farnell.com/cad/1737268.pdf?src-supplier=Element14; ComponentLink2URL: https://katalog.we-online.de/em/datasheet/6130xx11121.pdf?src-supplier=Digi-Key; ComponentLink2Description: https://katalog.we-online.de/em/datasheet/6130xx11121.pdf?src-supplier=Digi-Key; Manufacturer: Wurth Electronics; Manufacturer Part Number 1: 61300311121
J55 = Jumper: Manufacturer Part Number 1: 961102-6404-AR; Part Description: 2 Positions Header, Unshrouded Connector 0.100" (2.54mm) Through Hole Gold; Manufacturer: 3M; Connector Type: Header, Unshrouded; Supplier 1: Digi-Key; Supplier Part Number 1: 3M9447-ND; Contact Type: Male Pin; Color: Black; Mounting Type: Through Hole; Category: Connectors, Interconnects; Contact Finish: Gold
J56 J57 = RF_IF_connector: CONN UMC RCPT STR 50 OHM SMD; Manufacturer: Molex, LLC; Manufacturer Part Number 1: 0734120110; Body Finish: Nickel; Body Material: Phosphor Bronze; Center Contact Material: Brass; Center Contact Plating: Gold; Connector Style: Ultra Miniature Coaxial; Connector Type: Jack, Male Pin; Contact Termination: Solder; Dielectric Material: Liquid Crystal Polymer (LCP); Frequency - Max: 6GHz; Impedance: 50 Ohm; Voltage Rating: 60V; Cable Group: -; Category: Connectors, Interconnects; Fastening Type: Snap-On; Features: -; Housing Color: Silver; Ingress Protection: -; Mounting Type: Surface Mount; Operating Temperature: -40°C ~ 90°C; Packaging: Cut Tape (CT); RoHS: RoHS Compliant; Shield Termination: Solder; Supplier 1: Digi-Key; Supplier Part Number 1: WM5587CT-ND; Part Description: CONN UMC RCPT STR 50 OHM SMD
JMP2-JMP6 JMP8 = JUMP_2P_CONN_HEADER: Shorting Jumper, 2-position, 1.27mm pitch; Part Description: 2 (1 x 2) Position Shunt Connector Black Closed Top 0.100" (2.54mm) Gold; Manufacturer: Sullins; Manufacturer Part Number 1: SPC02SYAN; Number of Positions: 2; Pitch: 0.1inch; Supplier 1: Digi-Key; Supplier Part Number 1: S9001-ND; Stock 1: 570741; Pricing 1: 1=0.1, 10=0.059, 25=0.044, 50=0.0378, 100=0.0365, 250=0.03152, 500=0.03024, 1000=0.02646, 2500=0.02394 (USD); Colour: Black; Contact Plating: Gold; Package Quantity: 1000; Packaging: Bulk; Height: 0.256inch; Lead Free: Lead Free; ComponentLink1URL: http://www.sullinscorp.com/images/SPC02SYAN-0-3293.pdf; ComponentLink1Description: http://www.sullinscorp.com/images/SPC02SYAN-0-3293.pdf; ComponentLink2URL: https://drawings-pdf.s3.amazonaws.com/11134.pdf; ComponentLink2Description: https://drawings-pdf.s3.amazonaws.com/11134.pdf
L11 = Inductor_0603: Manufacturer: COILCRAFT; Manufacturer Part Number: 0402HP-47NXJLU; Part Description: INDUCTOR, RF, 47NH, 5%, 2.4GHZ, SMD; Product Range:0402HP Series; Inductance:47nH; Inductance Tolerance:± 5%; High Frequency Inductor Case:0402 [1005 Metric]; Self Resonant Frequency Min:2.4GHz; DC Resistance Max:0.58ohm; DC Current Rating:420mA; SVHC: No SVHC (15-Jun-2015); Inductance Tolerance: ± 5%; High Frequency Inductor Case: 0402 [1005 Metric]; Inductance: 47; DC Resistance Max: 0.58; Self Resonant Frequency Min: 2.4; Product Range: 0402; DC Current Rating: 420; Inductor Construction: Wirewound; Supplier 1: Farnell; Supplier Part Number 1: 2285856; Packaging: Cut Tape; Inductor Case Style: 0402 [1005 Metric]; RoHS: Y-EX; value: 47nH; Manufacturer Part Number 1: 0402HP-47NXJLU
R16 R23 = Res_0402: Manufacturer: Yageo; Part Description: RES SMD 0.0OHM JUMPER 1/16W 0402; Manufacturer Part Number 1: RC0402JR-070RL; Power (Watts): 0.063W, 1/16W; Resistance (Ohms): 0.0; Tolerance: Jumper; Supplier 1: Digi-Key; Supplier Part Number 1: 311-0.0JRTR-ND; Composition: Thick Film; Package / Case: 0402 (1005 Metric); Category: Resistors; Value: 0R; Features: Moisture Resistant; Height: 0.016" (0.40mm); Number of Terminations: 2; Operating Temperature: -55°C ~ 155°C; Packaging: Tape & Reel (TR); RoHS: RoHS Compliant; Size / Dimension: 0.039" L x 0.020" W (1.00mm x 0.50mm); Supplier Device Package: 0402; Temperature Coefficient: -
R153 R171 R173 R285 R286 R292-R294 R297 R299 R301 R302 R308-R310 R312-R317 R319-R321 = Res_0402: Manufacturer Part Number 1: RC0402JR-070RL; Manufacturer: Yageo; Part Description: RES SMD 0.0OHM JUMPER 1/16W 0402; Resistance (Ohms): 0.0; Tolerance: Jumper; Power (Watts): 0.063W, 1/16W; Value: 0R; Supplier 1: Digi-Key; Supplier Part Number 1: 311-0.0JRTR-ND; Category: Resistors; Temperature Coefficient: -; Features: Moisture Resistant; Supplier Device Package: 0402; Height: 0.016" (0.40mm); Package / Case: 0402 (1005 Metric); Operating Temperature: -55°C ~ 155°C; Size / Dimension: 0.039" L x 0.020" W (1.00mm x 0.50mm); Composition: Thick Film; Packaging: Tape & Reel (TR); Number of Terminations: 2; RoHS: RoHS Compliant
R183 = Res_0402: Manufacturer: Yageo; Manufacturer Part Number 1: RC0402FR-0710KL; Part Description: RES SMD 10K OHM 1% 1/16W 0402; Temperature Coefficient: ±100ppm/°C; Power (Watts): 0.063W, 1/16W; Value: 10k, 1%; Supplier 1: Digi-Key; Supplier Part Number 1: 311-10.0KLRTR-ND; Resistance (Ohms): 10k; Packaging: Tape & Reel (TR); RoHS: RoHS Compliant; Package / Case: 0402 (1005 Metric); Tolerance: ±1%; Operating Temperature: -55°C ~ 155°C; Size / Dimension: 0.039" L x 0.020" W (1.00mm x 0.50mm); Number of Terminations: 2; Category: Resistors; Height: 0.016" (0.40mm); Supplier Device Package: 0402; Features: Moisture Resistant; Composition: Thick Film
R288 = Res_0402: Manufacturer: Stackpole Electronics; Manufacturer Part Number 1: RMCF0402FT10R0; Part Description: 10 Ohms ±1% 0.063W, 1/16W Chip Resistor 0402 (1005 Metric) Automotive AEC-Q200 Thick Film; Power Rating: 63mW; Temperature Coefficient: 100ppm/°C; Value: 10R, 1%; Supplier 1: Digi-Key; Supplier Part Number 1: RMCF0402FT10R0CT-ND; Stock 1: 4909487; Pricing 1: 1=0,10000, 10=0,01400, 100=0,00560, 1000=0,00253, 2500=0,00220, 5000=0,00181 (USD); RoHS: Yes; Mount: Surface Mount; Case/Package: 0402; Case Code (Metric): 1005; Case Code (Imperial): 0402; Contact Plating: Tin,Matte; Size Code: 0402; Min Operating Temperature: -55°C; Max Operating Temperature: 155°C; Resistance: 10R; Tolerance: 1%; Packaging: Tape and Reel; Resistor Type: Thick Film; Number of Terminations: 2; Max Power Dissipation: 63mW; Features: Automotive AEC-Q200; Series: RMCF; Construction: Rectangular; Length: 0.039inch; Width: 0.02inch; Height: 0.016inch; Depth: 0.5mm; Radiation Hardening: No; Lead Free: Lead Free; Military Standard: Not; RoHS Compliant: Yes; ComponentLink1URL: http://components.arrow.com/part/dataview/44988361S6966751N1174?src-supplier=Arrow+Electronics; ComponentLink1Description: http://components.arrow.com/part/dataview/44988361S6966751N1174?src-supplier=Arrow+Electronics; ComponentLink2URL: https://www.seielect.com/catalog/SEI-RMCF_RMCP.pdf?src-supplier=Avnet; ComponentLink2Description: https://www.seielect.com/catalog/SEI-RMCF_RMCP.pdf?src-supplier=Avnet; ComponentLink3URL: https://www.seielect.com/catalog/SEI-Packaging.pdf?src-supplier=Digi-Key; ComponentLink3Description: https://www.seielect.com/catalog/SEI-Packaging.pdf?src-supplier=Digi-Key; ComponentLink4URL: http://www.seielect.com/Catalog/SEI-RMCF_RMCP.pdf?src-supplier=Future+Electronics; ComponentLink4Description: http://www.seielect.com/Catalog/SEI-RMCF_RMCP.pdf?src-supplier=Future+Electronics
R311 = Res_0402: Manufacturer: Samsung Electro-Mechanics America, Inc.; Part Description: RES SMD 49.9 OHM 1% 1/16W 0402; Manufacturer Part Number 1: RC1005F49R9CS; Temperature Coefficient: ±100ppm/°C; Resistance (Ohms): 49.9; Power (Watts): 0.063W, 1/16W; Number of Terminations: 2; Size / Dimension: 0.039" L x 0.020" W (1.00mm x 0.50mm); Supplier Device Package: 0402 (1005 Metric); RoHS: RoHS Compliant; Supplier Part Number 1: 1276-3469-6-ND; Features: -; Packaging: Digi-Reel®; Tolerance: ±1%; Height: 0.016" (0.40mm); Category: Resistors; Composition: Thick Film; Package / Case: 0402 (1005 Metric); Supplier 1: Digi-Key; Operating Temperature: -55°C ~ 155°C; Value: 49.9R, 1%
R318 = Res_0402: Part Description: RES SMD 22 OHM 1% 1/16W 0402; Manufacturer Part Number 1: RC0402FR-0722RL; Manufacturer: Yageo; Temperature Coefficient: ±100ppm/°C; Resistance (Ohms): 22; Supplier 1: Digi-Key; Supplier Part Number 1: 311-22.0LRTR-ND; Tolerance: ±1%; Supplier Device Package: 0402; Composition: Thick Film; Category: Resistors; Value: 22R, 1%
XO6 = AOCJYR-10.000MHz: Manufacturer: Rakon; Part Description: ROM9070PA 10.0MHz MERC+ 9x7 HOT CMOS 3.3V PULL; Oscillator Output Compatibility: CMOS; Oscillator Case: SMD, 9.7mm x 7.5; Supply Voltage Nom: 3.3; Frequency Nom, MHz: 10.0; Frequency Stability +/-, ppb: 20; Manufacturer Part Number 1: U8073LF; Supplier Part Number 1: U8073LF; Supplier 1: Rakon
XO7 = RPT7050A: Part Description: TCXO 30.72MHz, E6245LF; Manufacturer: Rakon; Manufacturer Part Number 1: E6245LF; Supplier 1: Rakon; Supplier Part Number 1: E6245LF
XO8 = TXCO: Part Description: TCXO 30.72MHz, E5280LF; Manufacturer: Rakon; Manufacturer Part Number 1: E5280LF; Supplier 1: Rakon; Supplier Part Number 1: E5280LF
XO9 = Rakon_RTX5032A: Part Description: RTX5032A 40MHz, High performance TCXO, With VC, Filter Enabled, 10-pin 5mm x 3.2 mm x 1.65 mm package; Manufacturer: Rakon; Manufacturer Part Number 1: RTX5032A; Supplier Part Number 1: RTX5032A; Supplier 1: RAKON
XO10 = ASVTX-12-A-38.400MHZ-H10-T_CRYSTAL: Oscillator Crystal; Manufacturer: Abracon; Part Description: 38.4MHz VCTCXO Clipped Sine Wave Oscillator 3V  4-SMD, No Lead; Operating Supply Voltage: 3V; Frequency Stability: 1ppm; Max Supply Current: 2.5mA; Supplier 1: Digi-Key; Manufacturer Part Number 1: ASVTX-12-A-38.400MHZ-H10-T; Stock 1: 1680; Pricing 1: 1 = 3,58000, 10 = 3,41000, 50 = 3,23960, 100 = 2,89850, 500 = 2,72800 (USD); RoHS: Yes; Mount: Surface Mount; Case/Package: SMD/SMT; Min Operating Temperature: -30°C; Max Operating Temperature: 85°C; Frequency: 38.4MHz; Package Quantity: 1000; Packaging: Tape and Reel; Termination: SMD/SMT; Length: 0.098inch; Height: 0.035inch; Width: 0.079inch; ComponentLink1URL: https://datasheet.ciiva.com/5466/astx12-asvtx12-8609-5466673.pdf?src-supplier=Mouser; ComponentLink1Description: https://datasheet.ciiva.com/5466/astx12-asvtx12-8609-5466673.pdf?src-supplier=Mouser; ComponentLink2URL: https://datasheet.ciiva.com/867/astx12-asvtx12-867453.pdf?src-supplier=Digi-Key; ComponentLink2Description: https://datasheet.ciiva.com/867/astx12-asvtx12-867453.pdf?src-supplier=Digi-Key; ComponentLink3URL: https://datasheet.ciiva.com/867/astx12-asvtx12-867454.pdf?src-supplier=Digi-Key; ComponentLink3Description: https://datasheet.ciiva.com/867/astx12-asvtx12-867454.pdf?src-supplier=Digi-Key; ComponentLink4URL: https://datasheet.ciiva.com/867/astx12-asvtx12-867455.pdf?src-supplier=Digi-Key; ComponentLink4Description: https://datasheet.ciiva.com/867/astx12-asvtx12-867455.pdf?src-supplier=Digi-Key; Supplier Part Number 1: 535-11790-1-ND